# EAGLE design cyclops (EAGLE 7.5.0)
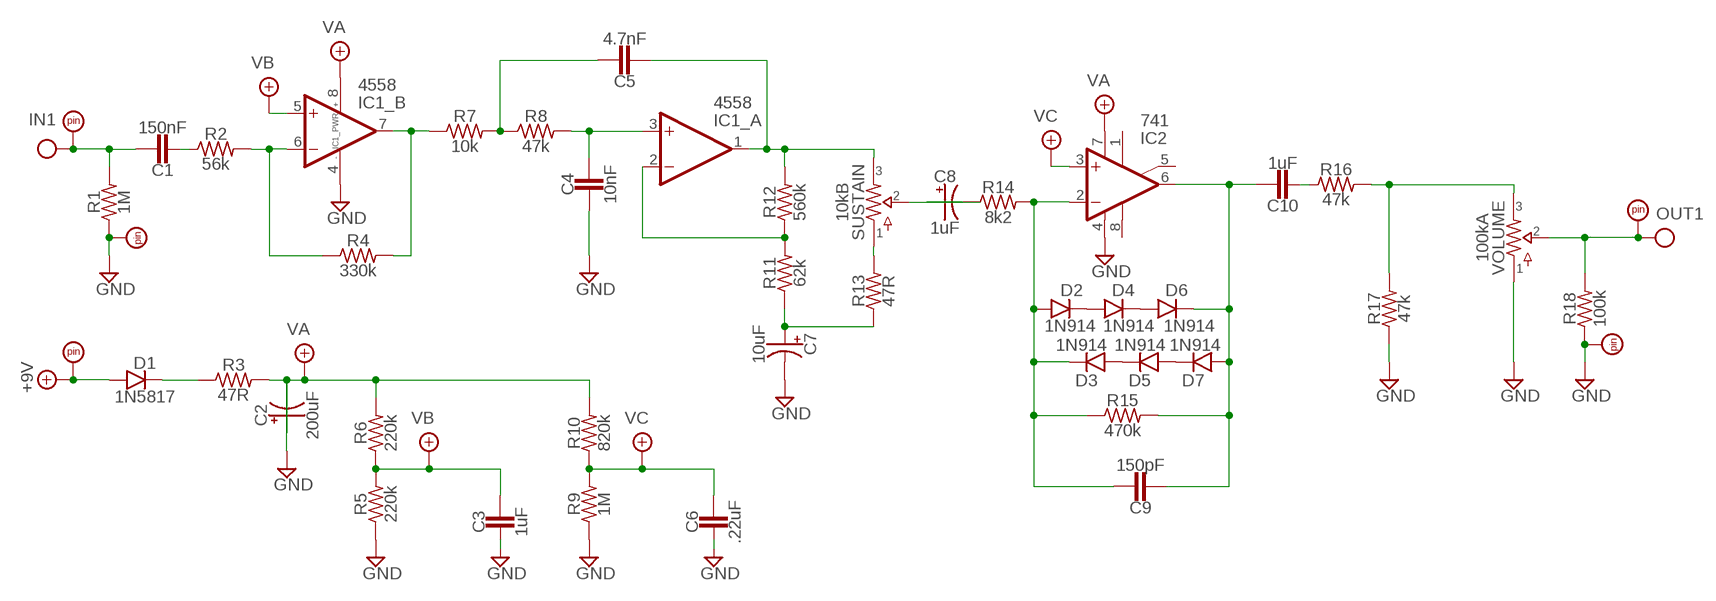
[diagram p0: schematic, sheet 1]

## Parts
C1  150nF  CER/FILMBOX.1  [BOX_SMALL]
C2  200uF  0631  [063_025]
C3  1uF  CER/FILMBOX.2  [BOX_MED]
C4  10nF  CER/FILMBOX.1  [BOX_SMALL]
C5  4.7nF  CER/FILMBOX.1  [BOX_SMALL]
C6  .22uF  CER/FILMBOX.1  [BOX_SMALL]
C7  10uF  0501  [050_020_1]
C8  1uF  0501  [050_020_1]
C9  150pF  CER/FILMBOX.1  [BOX_SMALL]
C10  1uF  CER/FILMBOX.2  [BOX_MED]
D1  1N5817  DO41.2  [DO41-2]
D2  1N914  DO35.2  [DO35-2]
D3  1N914  DO35.2  [DO35-2]
D4  1N914  DO35.2  [DO35-2]
D5  1N914  DO35.2  [DO35-2]
D6  1N914  DO35.2  [DO35-2]
D7  1N914  DO35.2  [DO35-2]
IC1  4558  DUALTH  [DIL08]
IC2  741  SINGLETH  [DIL08]
PAD1  PADSQR  [SQUARE]
PAD2  PADSQR  [SQUARE]
PAD3  PADRND  [ROUND]
PAD4  PADRND  [ROUND]
PAD5  PADSQR  [SQUARE]
R1  1M  R_.2  [R0207/2V]
R2  56k  R_.2  [R0207/2V]
R3  47R  R_.2  [R0207/2V]
R4  330k  R_.2  [R0207/2V]
R5  220k  R_.2  [R0207/2V]
R6  220k  R_.2  [R0207/2V]
R7  10k  R_.2  [R0207/2V]
R8  47k  R_.2  [R0207/2V]
R9  1M  R_.2  [R0207/2V]
R10  820k  R_.2  [R0207/2V]
R11  62k  R_.2  [R0207/2V]
R12  560k  R_.2  [R0207/2V]
R13  47R  R_.2  [R0207/2V]
R14  8k2  R_.2  [R0207/2V]
R15  470k  R_.2  [R0207/2V]
R16  47k  R_.2  [R0207/2V]
R17  47k  R_.2  [R0207/2V]
R18  100k  R_.2  [R0207/2V]
SUSTAIN  10kB  POTSTRIM  [2262_TRIM]
VOLUME  100kA  POTSSMALL_PADS  [PADS_SMALL]

## Nets
+9V: D1.A PAD1.1
GND: C2.- C3.2 C4.2 C6.2 C7.- IC1.4(_PWR:V-) IC2.4(V-) PAD3.1 PAD4.1 R1.1 R5.1 R9.1 R17.1 R18.1 VOLUME.1
IN: C1.1 PAD2.1 R1.2
N$1: C1.2 R2.1
N$2: C10.2 R16.1
N$3: R16.2 R17.2 VOLUME.3
N$4: IC1.6(_B:-IN) R2.2 R4.1
N$5: IC1.7(_B:OUT) R4.2 R7.1
N$6: C5.1 R7.2 R8.1
N$7: C4.1 IC1.3(_A:+IN) R8.2
N$8: C5.2 IC1.1(_A:OUT) R12.2 SUSTAIN.3
N$9: IC1.2(_A:-IN) R11.2 R12.1
N$10: C7.+ R11.1 R13.1
N$11: R13.2 SUSTAIN.1
N$12: D1.C R3.1
N$13: C8.- SUSTAIN.2
N$14: C8.+ R14.1
N$16: C9.1 D2.A D3.C IC2.2(-IN) R14.2 R15.1
N$17: D2.C D4.A
N$18: D4.C D6.A
N$19: D5.A D7.C
N$20: D3.A D5.C
N$21: C9.2 C10.1 D6.C D7.A IC2.6(OUT) R15.2
OUT: PAD5.1 R18.2 VOLUME.2
VA: C2.+ IC1.8(_PWR:V+) IC2.7(V+) R3.2 R6.2 R10.2
VB: C3.1 IC1.5(_B:+IN) R5.2 R6.1
VC: C6.1 IC2.3(+IN) R9.2 R10.1
Unconnected: IC2.1(ON1) IC2.5(ON2) IC2.8(OPT)

## Library data of the parts
C1 C3-C6 C9 C10 = capacitors-film:CER/FILM: 47 - 120pF Xicon Ceramic Disc 2.5mm lead spacing
C2 = capacitors-elec:063: 33 - 220uF Xicon values at Mouser.com 10V: 220uF; 16V: 100uF; 25V: 100uF; 50V: 33uF
C7 C8 = capacitors-elec:050: 0.22 - 100uF Xicon values at Mouser.com: 10V: 10 - 100uF; 16V: 2.2 - 47uF; 25V: 0.47 - 47uF; 50V: 0.22 - 22uF
D1 = diodes:DO41: DO-41 Package Diodes: 1N4001 - 1N40019 Zener Diodes: 1N4728 - 1N4764
D2-D7 = diodes:DO35: DO-35 Package Diodes: 1N914
IC1 = integrated circuits:DUAL: OP AMP
IC2 = integrated circuits:SINGLE: OP AMP
PAD1-PAD5 = supply pins:PAD
R1-R18 = resistors:R_
SUSTAIN VOLUME = potentiometers:POTS

## Board
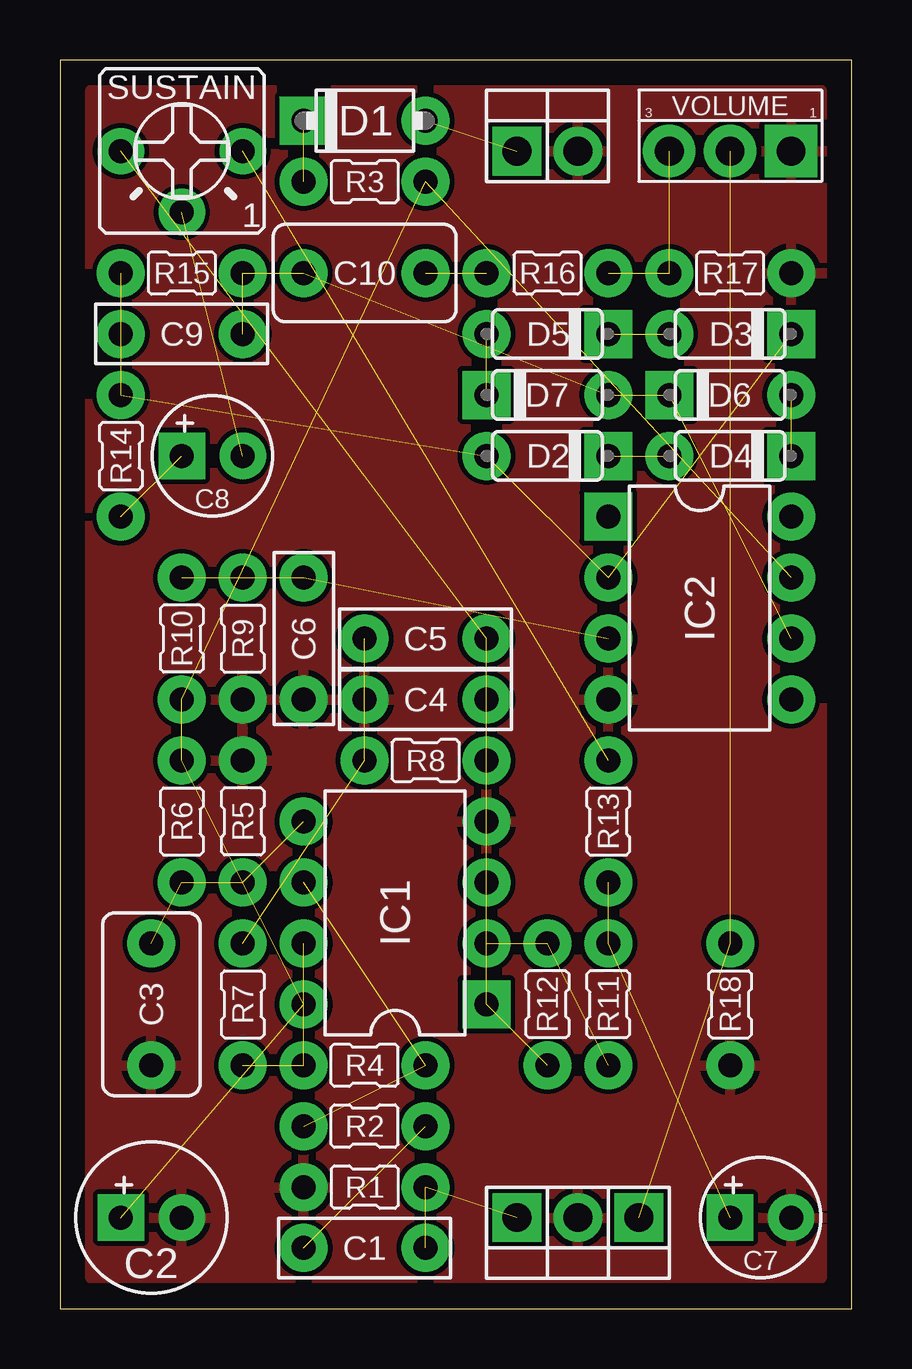
[diagram p1: board, top side]
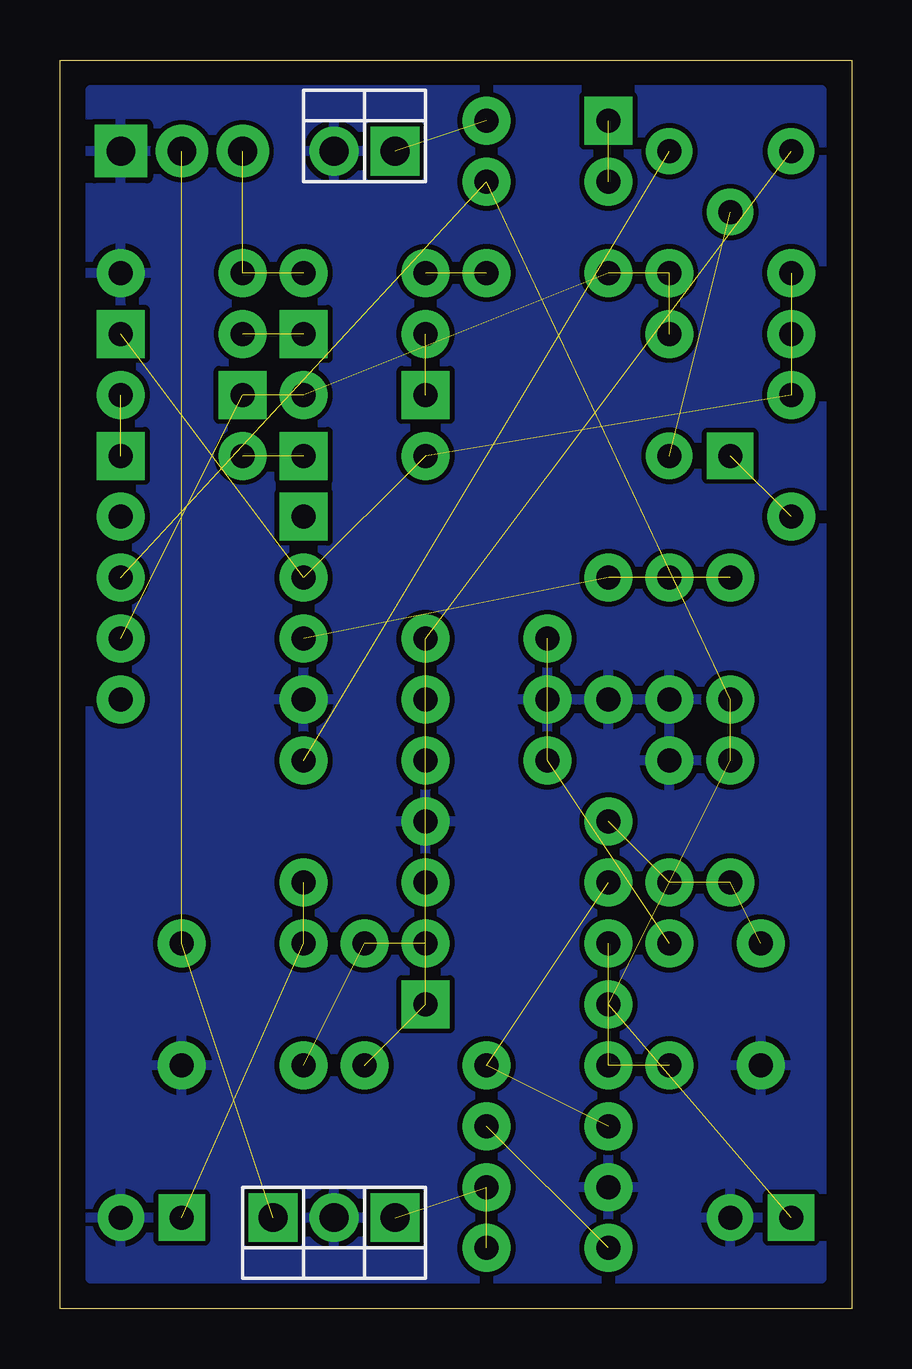
[diagram p2: board, bottom side, seen from below]

Size 33.02 x 52.06 mm. Coordinates in mm from the lower left corner, seen from the top.
Outline: 0,0 33.02,0 33.02,52.06 0,52.06 0,0
Copper layers (1*16): Top 0.035mm / dielectric 1.5mm / Bottom 0.035mm
Design rules "default": minimum track width 10mil, minimum drill 24mil, track to track 8mil, track to pad 8mil, pad to pad 8mil, via to via 8mil, smd to smd 8mil, copper to edge 40mil, drill to drill 8mil, minimum pad ring 10mil, minimum via ring 8mil, stop-mask expansion 4mil, vias tented up to drill 0mil, thermal gap 10mil

### Footprints (pad centres in the part's own frame; a part is rotated, then mirrored left to right if it is on the bottom)
BOX_SMALL = drill 1 pad 2: 1 -2.54,0; 2 2.54,0
063_025 = drill 1 pad 1.93 square: + -1.27,0 | drill 1 pad 1.93: - 1.27,0
BOX_MED = drill 1 pad 2: 1 -2.54,0; 2 2.54,0
050_020_1 = drill 1 pad 1.93 square: + -1.27,0 | drill 1 pad 1.93: - 1.27,0
DO41-2 = drill 1 pad 2: A 2.54,0 | drill 1 pad 2 square: C -2.54,0
DO35-2 = drill 1 pad 2: A 2.54,0 | drill 1 pad 2 square: C -2.54,0
DIL08 = drill 1 pad 2 square: 1 -3.81,-3.81 | drill 1 pad 2: 2 -1.27,-3.81; 3 1.27,-3.81; 4 3.81,-3.81; 5 3.81,3.81; 6 1.27,3.81; 7 -1.27,3.81; 8 -3.81,3.81
SQUARE = drill 1.2 pad 2.032 square: 1 0,0
ROUND = drill 1.2 pad 2.032: 1 0,0
R0207/2V = drill 1 pad 2: 1 -2.54,0; 2 2.54,0
2262_TRIM = drill 1 pad 1.93: 1 -2.54,0; 2 0,2.54; 3 2.54,0
PADS_SMALL = drill 1.2 pad 2.184 square: 1 2.54,0 | drill 1.2 pad 2.184: 2 0,0; 3 -2.54,0

### Placement (x,y rotation side)
C1  12.7,2.54 180 top
C2  3.81,3.81 0 top
C3  3.81,12.7 270 top
C4  15.24,25.4 180 top
C5  15.24,27.94 0 top
C6  10.16,27.94 270 top
C7  29.21,3.81 0 top
C8  6.35,35.56 0 top
C9  5.08,40.64 0 top
C10  12.7,43.18 0 top
D1  12.7,49.53 0 top
D2  20.32,35.56 180 top
D3  27.94,40.64 180 top
D4  27.94,35.56 180 top
D5  20.32,40.64 180 top
D6  27.94,38.1 0 top
D7  20.32,38.1 0 top
IC1  13.97,16.51 90 top
IC2  26.67,29.21 270 top
PAD1  19.05,48.26 180 top
PAD2  19.05,3.81 0 top
PAD3  21.59,48.26 180 top
PAD4  21.59,3.81 0 top
PAD5  24.13,3.81 0 top
R1  12.7,5.08 0 top
R2  12.7,7.62 180 top
R3  12.7,46.99 0 top
R4  12.7,10.16 180 top
R5  7.62,20.32 270 top
R6  5.08,20.32 90 top
R7  7.62,12.7 90 top
R8  15.24,22.86 0 top
R9  7.62,27.94 90 top
R10  5.08,27.94 270 top
R11  22.86,12.7 270 top
R12  20.32,12.7 270 top
R13  22.86,20.32 90 top
R14  2.54,35.56 90 top
R15  5.08,43.18 0 top
R16  20.32,43.18 0 top
R17  27.94,43.18 180 top
R18  27.94,12.7 90 top
SUSTAIN  5.08,48.26 180 top
VOLUME  27.94,48.26 0 top

### Tracks (layer width: path | path; a pad name or v marks a point on that pad's centre or on a via)
+9V  (1 unrouted)
GND
  pour Bottom: 1.27,50.8 31.75,50.8 31.75,1.27 1.27,1.27
  pour Top: 1.27,50.8 31.75,50.8 31.75,1.27 1.27,1.27
IN  (2 unrouted)
N$1  (1 unrouted)
N$2  (1 unrouted)
N$3  (2 unrouted)
N$4  (2 unrouted)
N$5  (2 unrouted)
N$6  (2 unrouted)
N$7  (2 unrouted)
N$8  (3 unrouted)
N$9  (2 unrouted)
N$10  (2 unrouted)
N$11  (1 unrouted)
N$12  (1 unrouted)
N$13  (1 unrouted)
N$14  (1 unrouted)
N$16  (5 unrouted)
N$17  (1 unrouted)
N$18  (1 unrouted)
N$19  (1 unrouted)
N$20  (1 unrouted)
N$21  (5 unrouted)
OUT  (2 unrouted)
VA  (5 unrouted)
VB  (3 unrouted)
VC  (3 unrouted)